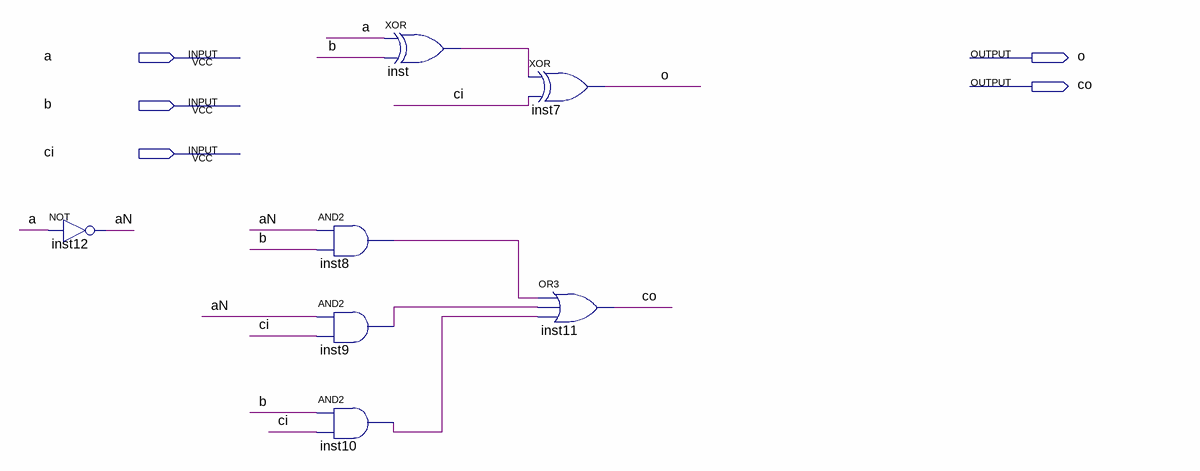
[diagram p0: schematic sheet]
// Quartus schematic SUB1.bdf as structural Verilog: 7 symbols, 5 pins
module SUB1 (
  input  a,
  input  b,
  input  ci,
  output o,
  output co
);

  wire aN, inst8_out, inst9_out, inst10_out, inst_out;

  not inst12 (aN, a);
  and inst8 (inst8_out, aN, b);
  and inst9 (inst9_out, aN, ci);
  and inst10 (inst10_out, b, ci);
  xor inst (inst_out, a, b);
  xor inst7 (o, inst_out, ci);
  or inst11 (co, inst8_out, inst9_out, inst10_out);
endmodule
